# EAGLE design pi_mcu_powerBoard (EAGLE 6.3)
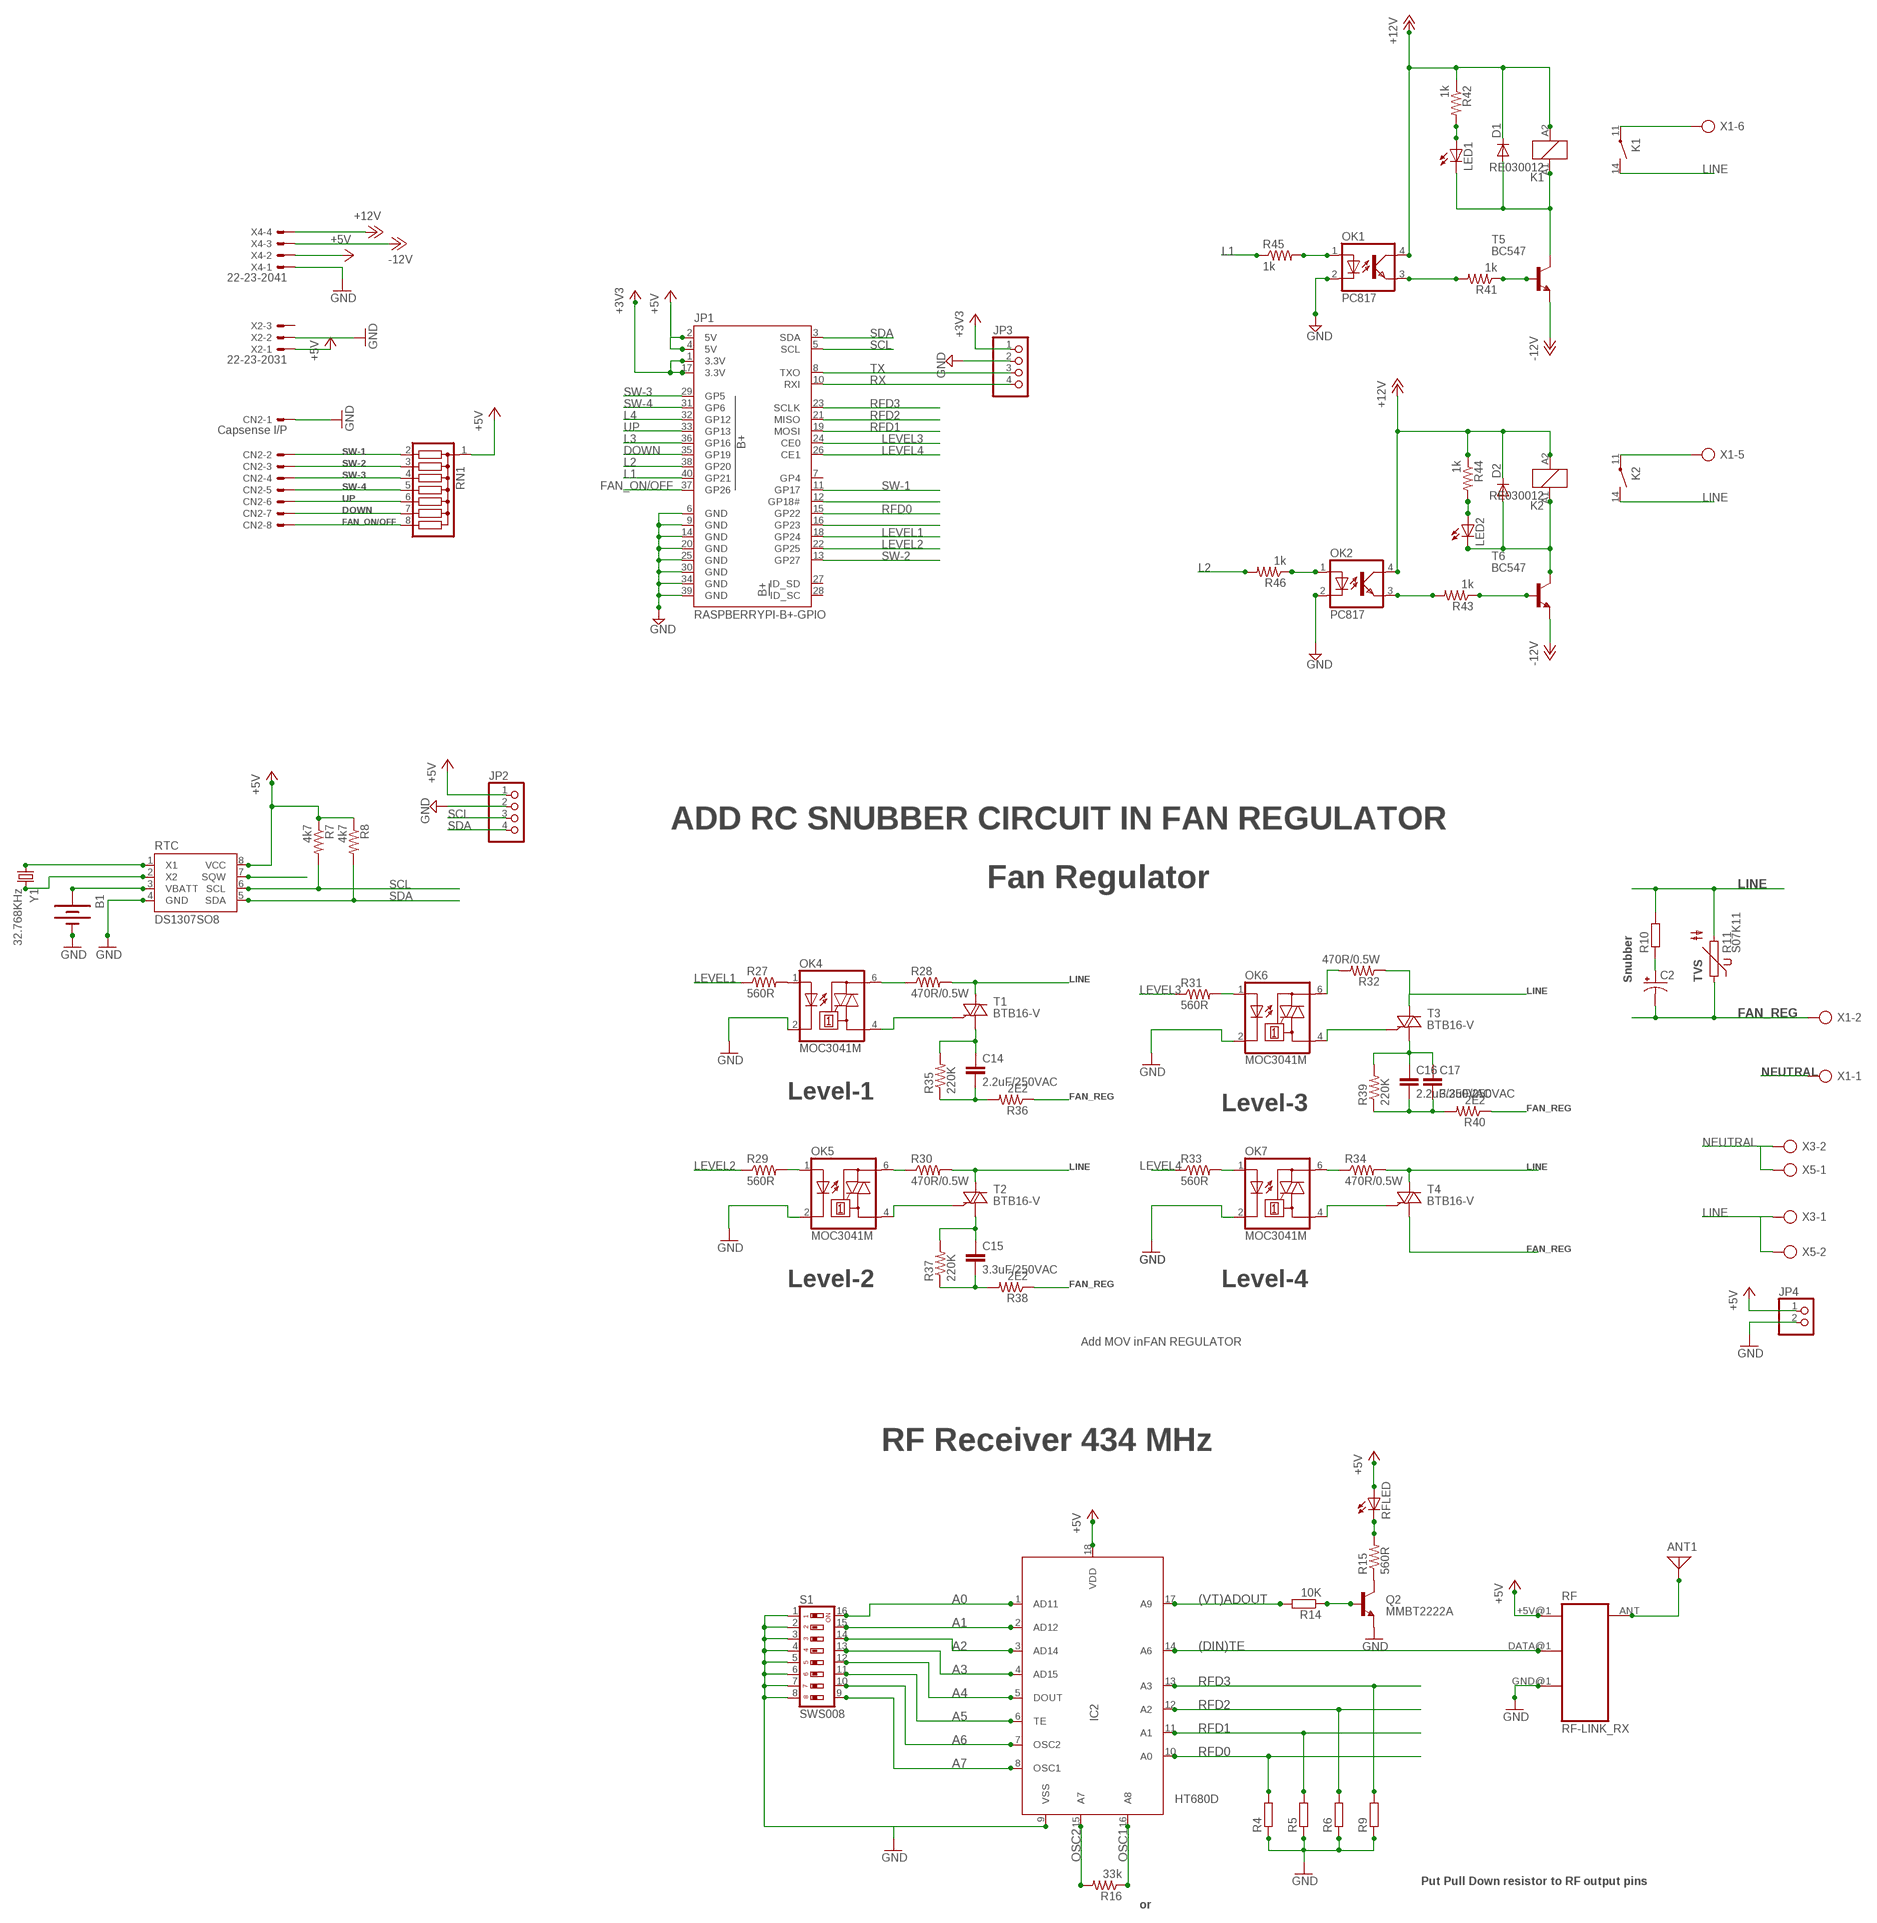
[diagram p0: schematic, sheet 1, part 1 of 2]
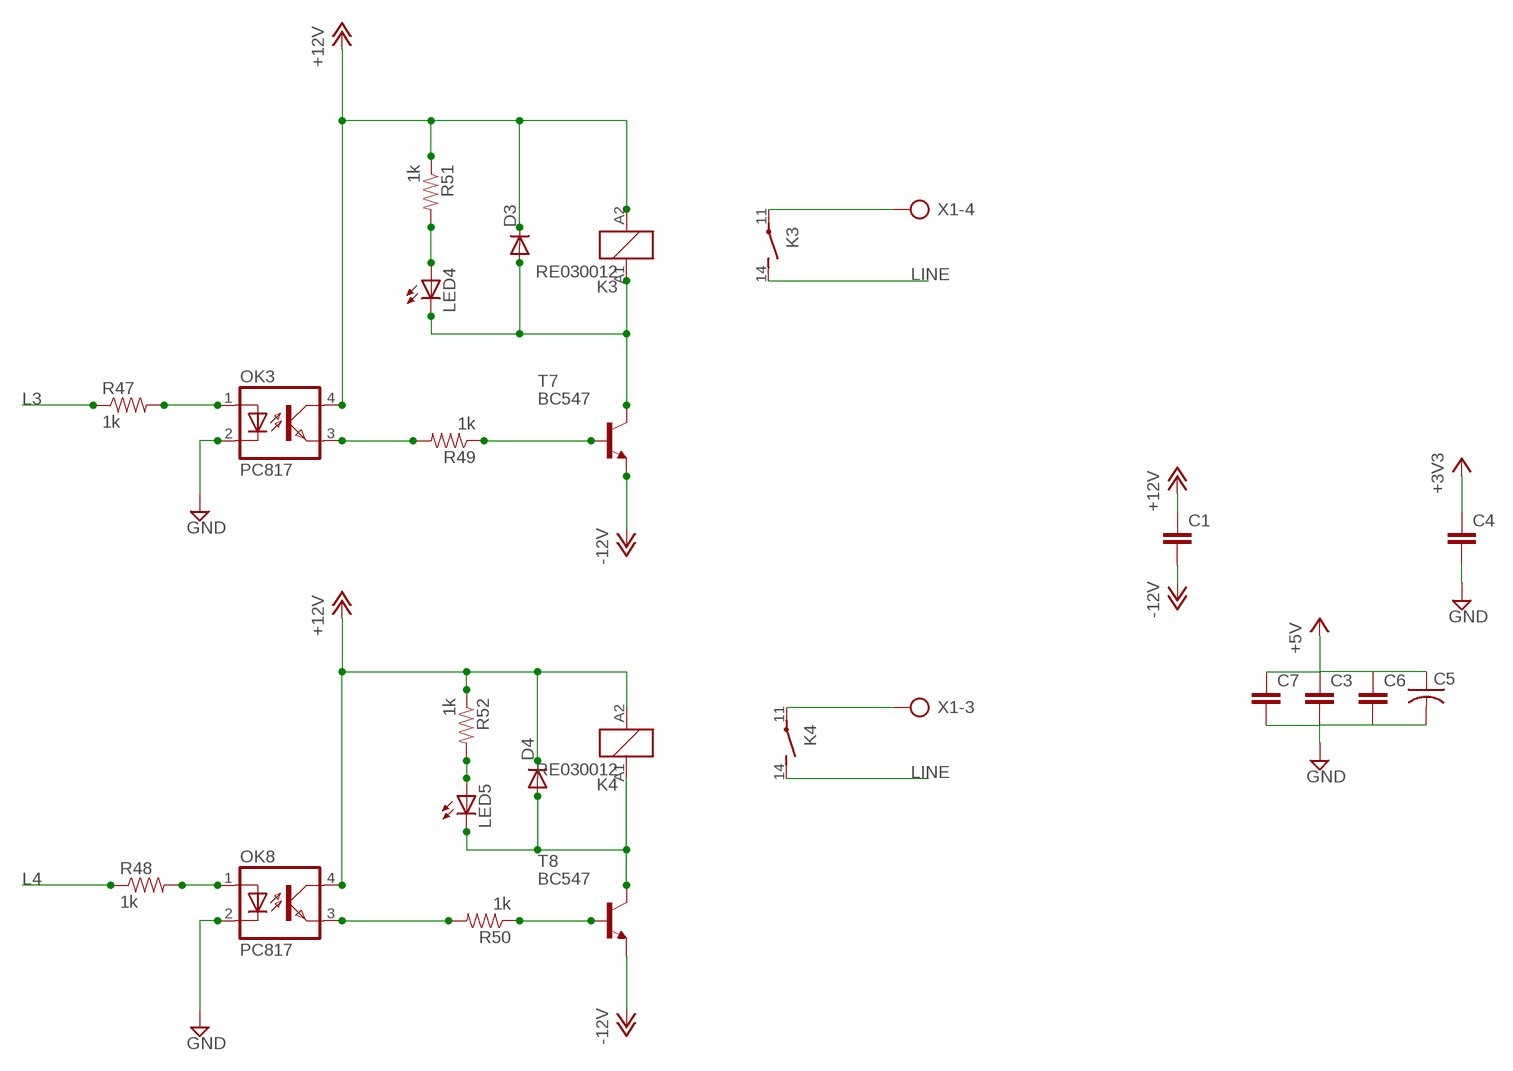
[diagram p1: schematic, sheet 1, part 2 of 2]

## Parts
ANT1  ANTENNA  [PAD-01]
B1  BATTERY20SMD  [BATTCON_20MM]
C1  C-EUC1206  [C1206]
C2  CPOL-USE5-9VAXIAL  [E5R]
C3  C-EUC1206  [C1206]
C4  C-EUC1206  [C1206]
C5  C-USC1206  [C1206]
C6  C-EUC1206  [C1206]
C7  C-EUC1206  [C1206]
C14  2.2uF/250VAC  C27/9  [C27.5B9]
C15  3.3uF/250VAC  C27/9  [C27.5B9]
C16  2.2uF/250VAC  C27/9  [C27.5B9]
C17  3.3uF/250VAC  C27/9  [C27.5B9]
CN2  Capsense I/P  22-23-2081  [22-23-2081]
D1  DIODE-D-2.5  [D-2.5]
D2  DIODE-D-2.5  [D-2.5]
D3  DIODE-D-2.5  [D-2.5]
D4  DIODE-D-2.5  [D-2.5]
IC2  HT680D  [SOP18]
JP1  RASPBERRYPI-B+-GPIO  [2X20-SHROUDED]
JP2  PINHD-1X4  [1X04]
JP3  PINHD-1X4  [1X04]
JP4  PINHD-1X2  [1X02]
K1  RE030012  [RE-SCHRACK]
K2  RE030012  [RE-SCHRACK]
K3  RE030012  [RE-SCHRACK]
K4  RE030012  [RE-SCHRACK]
LED1  LED3MM  [LED3MM]
LED2  LED3MM  [LED3MM]
LED4  LED3MM  [LED3MM]
LED5  LED3MM  [LED3MM]
OK1  PC817  [DIL04]
OK2  PC817  [DIL04]
OK3  PC817  [DIL04]
OK4  MOC3041M  [DIL06]
OK5  MOC3041M  [DIL06]
OK6  MOC3041M  [DIL06]
OK7  MOC3041M  [DIL06]
OK8  PC817  [DIL04]
Q2  MMBT2222A  TRANSISTOR_NPNMMBT2222A  [SOT23-3]
R4  R-EU_0207/10  [0207/10]
R5  R-EU_0207/10  [0207/10]
R6  R-EU_0207/10  [0207/10]
R7  4k7  RESISTOR1206  [1206]
R8  4k7  RESISTOR1206  [1206]
R9  R-EU_0207/10  [0207/10]
R10  R-EU_0411/3V  [0411V]
R11  S07K11  [S07K11]
R14  10K  R-EU_0207/10  [0207/10]
R15  560R  RESISTOR1206  [1206]
R16  33k  RESISTOR1206  [1206]
R27  560R  RESISTOR1206  [1206]
R28  470R/0.5W  R-US_0411/3V  [0411V]
R29  560R  RESISTOR1206  [1206]
R30  470R/0.5W  R-US_0411/3V  [0411V]
R31  560R  RESISTOR1206  [1206]
R32  470R/0.5W  R-US_0411/3V  [0411V]
R33  560R  RESISTOR1206  [1206]
R34  470R/0.5W  R-US_0411/3V  [0411V]
R35  220K  RESISTOR1206  [1206]
R36  2E2  RESISTOR1206  [1206]
R37  220K  RESISTOR1206  [1206]
R38  2E2  RESISTOR1206  [1206]
R39  220K  RESISTOR1206  [1206]
R40  2E2  RESISTOR1206  [1206]
R41  1k  RESISTOR1206  [1206]
R42  1k  RESISTOR1206  [1206]
R43  1k  RESISTOR1206  [1206]
R44  1k  RESISTOR1206  [1206]
R45  1k  RESISTOR1206  [1206]
R46  1k  RESISTOR1206  [1206]
R47  1k  RESISTOR1206  [1206]
R48  1k  RESISTOR1206  [1206]
R49  1k  RESISTOR1206  [1206]
R50  1k  RESISTOR1206  [1206]
R51  1k  RESISTOR1206  [1206]
R52  1k  RESISTOR1206  [1206]
RF  RF-LINK_RX  [RF-LINK_RX]
RFLED  LED3MM  [LED3MM]
RN1  G07R  [SIL8]
RTC  DS1307SO8  [SO08]
S1  SWS008  [SMS-008]
T1  BTB16-V  BT138-V  [TO220BV]
T2  BTB16-V  BT138-V  [TO220BV]
T3  BTB16-V  BT138-V  [TO220BV]
T4  BTB16-V  BT138-V  [TO220BV]
T5  BC547  [TO92]
T6  BC547  [TO92]
T7  BC547  [TO92]
T8  BC547  [TO92]
X1  AK300/6  [AK300/6]
X2  22-23-2031  [22-23-2031]
X3  AK300/2  [AK300/2]
X4  22-23-2041  [22-23-2041]
X5  AK300/2  [AK300/2]
Y1  32.768KHz  CRYSTALTC26H  [TC26H]

## Nets
(DIN)TE: IC2.14(A6) RF.DATA@1(DATA)
(VT)ADOUT: IC2.17(A9) R14.2
+3V3: C4.1 JP1.1(3.3V) JP1.17(3.3V) JP3.1
+5V: C3.1 C5.1 C6.1 C7.1 IC2.18(VDD) JP1.2(5V) JP1.4(5V) JP2.1 JP4.1 R7.1 R8.1 RF.+5V@1(+5V) RFLED.A RN1.1 RTC.8(VCC) X2.1 X4.2
+12V: C1.1 D1.C D2.C D3.C D4.C K1.A2 K2.A2 K3.A2 K4.A2 OK1.4(COL) OK2.4(COL) OK3.4(COL) OK8.4(COL) R42.1 R44.1 R51.1 R52.1 X4.4
-12V: C1.2 T5.1(E) T6.1(E) T7.1(E) T8.1(E) X4.3
A0: IC2.1(AD11) S1.16
A1: IC2.2(AD12) S1.15
A2: IC2.3(AD14) S1.14
A3: IC2.4(AD15) S1.13
A4: IC2.5(DOUT) S1.12
A5: IC2.6(TE) S1.11
A6: IC2.7(OSC2) S1.10
A7: IC2.8(OSC1) S1.9
DOWN: CN2.7 JP1.35(GP19) RN1.7
FAN_ON/OFF: CN2.8 JP1.37(GP26) RN1.8
FAN_REG: C2.- R11.1 R36.1 R38.1 R40.1 T4.T1(A1) X1.2
GND: B1.2(-) C3.2 C4.2 C5.2 C6.2 C7.2 CN2.1 IC2.9(VSS) JP1.6(GND) JP1.9(GND) JP1.14(GND) JP1.20(GND) JP1.25(GND) JP1.30(GND) JP1.34(GND) JP1.39(GND) JP2.2 JP3.2 JP4.2 OK1.2(C) OK2.2(C) OK3.2(C) OK4.2(C) OK5.2(C) OK6.2(C) OK7.2(C) OK8.2(C) Q2.2(E) R4.1 R5.1 R6.1 R9.1 RF.GND@1(GND) RTC.4(GND) S1.1 S1.2 S1.3 S1.4 S1.5 S1.6 S1.7 S1.8 X2.2 X4.1
L1: JP1.40(GP21) R45.1
L2: JP1.38(GP20) R46.2
L3: JP1.36(GP16) R47.1
L4: JP1.32(GP12) R48.1
LEVEL1: JP1.18(GP24) R27.1
LEVEL2: JP1.22(GP25) R29.1
LEVEL3: JP1.24(CE0) R31.1
LEVEL4: JP1.26(CE1) R33.1
LINE: K1.14(2:S) K2.14(2:S) K3.14(2:S) K4.14(2:S) R10.2 R11.2 R28.2 R30.2 R32.1 R34.2 T1.T2(A2) T2.T2(A2) T3.T2(A2) T4.T2(A2) X3.1 X5.2
N$1: OK6.1(A) R31.2
N$2: OK4.1(A) R27.2
N$3: OK5.1(A) R29.2
N$4: OK4.6(A2) R28.1
N$5: OK7.1(A) R33.2
N$6: JP1.16(GP23)
N$7: OK1.3(EMIT) R41.2
N$8: JP1.12(GP18#)
N$9: R41.1 T5.2(B)
N$10: D1.A K1.A1 LED1.K(C) T5.3(C)
N$11: LED1.A R42.2
N$12: OK1.1(A) R45.2
N$13: RTC.2(X2) Y1.2
N$14: OK2.1(A) R46.1
N$15: OK2.3(EMIT) R43.2
N$16: R43.1 T6.2(B)
N$17: C2.+ R10.1
N$18: D2.A K2.A1 LED2.K(C) T6.3(C)
N$19: Q2.1(B) R14.1
N$20: RTC.7(SQW)
N$21: RTC.1(X1) Y1.1
N$22: K3.11(2:P) X1.4
N$23: B1.1(+) RTC.3(VBATT)
N$24: Q2.3(C) R15.1
N$25: LED2.A R44.2
N$26: K1.11(2:P) X1.6
N$27: R15.2 RFLED.K(C)
N$28: K2.11(2:P) X1.5
N$29: OK5.6(A2) R30.1
N$30: OK6.6(A2) R32.2
N$31: ANT1.1 RF.ANT
N$32: OK3.1(A) R47.2
N$33: OK8.3(EMIT) R50.2
N$34: OK7.6(A2) R34.1
N$35: OK3.3(EMIT) R49.2
N$36: R49.1 T7.2(B)
N$37: R50.1 T8.2(B)
N$38: D3.A K3.A1 LED4.K(C) T7.3(C)
N$39: K4.11(2:P) X1.3
N$40: LED4.A R51.2
N$41: D4.A K4.A1 LED5.K(C) T8.3(C)
N$43: LED5.A R52.2
N$44: OK8.1(A) R48.2
N$54: OK4.4(A1) T1.G
N$55: C14.1 R35.2 T1.T1(A1)
N$56: C14.2 R35.1 R36.2
N$62: OK5.4(A1) T2.G
N$63: C15.1 R37.2 T2.T1(A1)
N$64: C15.2 R37.1 R38.2
N$70: OK6.4(A1) T3.G
N$71: C16.1 C17.1 R39.2 T3.T1(A1)
N$72: C16.2 C17.2 R39.1 R40.2
N$78: OK7.4(A1) T4.G
NEUTRAL: X1.1 X3.2 X5.1
OSC1: IC2.16(A8) R16.1
OSC2: IC2.15(A7) R16.2
RFD0: IC2.10(A0) JP1.15(GP22) R4.2
RFD1: IC2.11(A1) JP1.19(MOSI) R5.2
RFD2: IC2.12(A2) JP1.21(MISO) R6.2
RFD3: IC2.13(A3) JP1.23(SCLK) R9.2
RX: JP1.10(RXI) JP3.4
SCL: JP1.5(SCL) JP2.3 R7.2 RTC.6(SCL)
SDA: JP1.3(SDA) JP2.4 R8.2 RTC.5(SDA)
SW-1: CN2.2 JP1.11(GP17) RN1.2
SW-2: CN2.3 JP1.13(GP27) RN1.3
SW-3: CN2.4 JP1.29(GP5) RN1.4
SW-4: CN2.5 JP1.31(GP6) RN1.5
TX: JP1.8(TXO) JP3.3
UP: CN2.6 JP1.33(GP13) RN1.6
Unconnected: JP1.7(GP4) JP1.27(ID_SD) JP1.28(ID_SC) X2.3

## Notes on the sheet
- ADD RC SNUBBER CIRCUIT IN FAN REGULATOR
- Fan Regulator
- Snubber | TVS
- Level-1
- Level-3
- Level-2 | Level-4
- Add MOV inFAN REGULATOR
- RF Receiver 434 MHz
- Put Pull Down resistor to RF output pins
- or

## Library data of the parts
ANT1 = discrete:ANTENNA: Antenna
B1 = SparkFun-Electromechanical:BATTERY: Battery Holders Various common sizes : AA, AAA, 18650 (PRT-12895), 20mm coin cell and 12mm coin cell. 20MM_4LEGS, BATT-10373
C1 C3 C4 C6 C7 = rcl:C-EU: CAPACITOR, European symbol
C2 = rcl:CPOL-US: POLARIZED CAPACITOR, American symbol
C5 = rcl:C-US: CAPACITOR, American symbol
C14-C17 = capacitor-wima:C: CAPACITOR naming: grid - package width
CN2 = con-molex:22-23-2081: .100" (2.54mm) Center Header - 8 Pin; MF: MOLEX; MPN: 22-23-2081; OC_FARNELL: 1756826; OC_NEWARK: 01C7592
D1-D4 = diode:DIODE-: DIODE
IC2 = holtek:HT680: 318 Series of Encoders TE trigger type Source: http://www.holtek.com.tw/pdf/consumer/3_18ev110.pdf; OC_FARNELL: unknown; OC_NEWARK: unknown
JP1 = SparkFun-Boards:RASPBERRYPI-B+-GPIO: Raspberry Pi B+ GPIO Header 2x20 pin connector
JP2 JP3 = pinhead:PINHD-1X4: PIN HEADER
JP4 = pinhead:PINHD-1X2: PIN HEADER
K1-K4 = relay:RE03*: Miniature PCB Relay 1 pole 6 A SCHRACK Source: http://www.schrack.com/.. 5812.pdf; MF: TYCO ELECTRONICS; MPN: RE030012; OC_FARNELL: 515840; OC_NEWARK: 17M1743
LED1 LED2 LED4 LED5 = adafruit:LED: LED
OK1-OK3 OK8 = optocoupler:PC817: SHARP OPTO COUPLER; MPN: PC817X4J000F; OC_FARNELL: 9707727; OC_NEWARK: 97K7059
OK4 = optocoupler:MOC30*: 6-Pin DIP Zero-Cross Optoisolators Triac Driver Output (250/400 Volt Peak) Source: Data sheet <http://www.fairchildsemi.com/ds/MO/MOC3031M.pdf> The old path of data sheet not more available 2013-05-06.; MF: FAIRCHILD SEMICONDUCTOR; MPN: MOC3041M; OC_FARNELL: 1086677; OC_NEWARK: 78K6090
OK5-OK7 = optocoupler:MOC30*: 6-Pin DIP Zero-Cross Optoisolators Triac Driver Output (250/400 Volt Peak) Source: Data sheet <http://www.fairchildsemi.com/ds/MO/MOC3031M.pdf> The old path of data sheet not more available 2013-05-06.; MF: FAIRCHILD SEMICONDUCTOR; MPN: MOC3031SM; OC_FARNELL: unknown; OC_NEWARK: 34C1335
Q2 = SparkFun-DiscreteSemi:TRANSISTOR_NPN: Generic NPN BJT MMBT2222A - TRANS-08049 (SOT-23, 1A 40V) MPSA42 - TRANS-09116 (SOT-23, 500mA 300V) MMBT5088LT1G - TRANS-11160 (SOT-23, 50 mA 30V) BC547 - COM-08928 <http://www.sparkfun.com/products/8928> (TO-92 45V 100mA) (1.Collector 2.Base 3.Emitter) 2N3904 - COM-00521 <http://www.sparkfun.com/products/521> (TO-92 40V 200mA) (1.Emitter 2.Base 3.Collector) P2N2222A - COM-12852 <http://www.sparkfun.com/products/12852> (TO-92 40V 600mA) (1.Collector 2.Base 3.Emitter); PROD_ID: TRANS-08049
R4-R6 R9 R10 R14 = rcl:R-EU_: RESISTOR, European symbol
R7 R8 = SparkFun-Passives:RESISTOR: Resistor Basic schematic elements and footprints for 0603, 1206, and PTH resistors.
R11 = varistor:S07K11: VARISTOR
R15 R16 R27 R29 R31 R33 R35-R52 = SparkFun-Resistors:RESISTOR: Resistor Basic schematic elements and footprints for 0603, 1206, and PTH resistors.
R28 R30 R32 R34 = rcl:R-US_: RESISTOR, American symbol
RF = SparkFun-RF:RF-LINK_RX: RF Link receivers- WRL-8947, 8948, 8949, 8950, 10532, 10533
RFLED = led:LED: LED
RN1 = resistor-sil:G07R: SIL RESISTOR; OC_FARNELL: unknown; OC_NEWARK: unknown
RTC = SparkFun-FreqCtrl:DS1307: I2C real-time clock with battery backup.
S1 = smd-special:SWS008: SMD Dip Switch 8 pol.
T1-T4 = triac:BT138: TRIAC Source: http://www.semiconductors.philips.com BT138_SERIES_2.pdf
T5-T8 = transistor:BC547: NPN TRANSISTOR
X1 = con-ptr500:AK300/6: CONNECTOR; OC_FARNELL: unknown; OC_NEWARK: unknown
X2 = con-molex:22-23-2031: .100" (2.54mm) Center Header - 3 Pin; MF: MOLEX; MPN: 22-23-2031; OC_FARNELL: 1462950; OC_NEWARK: 30C0862
X3 X5 = con-ptr500:AK300/2: CONNECTOR; OC_FARNELL: unknown; OC_NEWARK: unknown
X4 = con-molex:22-23-2041: .100" (2.54mm) Center Header - 4 Pin; MF: MOLEX; MPN: 22-23-2041; OC_FARNELL: 1462920; OC_NEWARK: 38C0355
Y1 = crystal:CRYSTAL: CRYSTAL; OC_FARNELL: unknown; OC_NEWARK: unknown

## Board
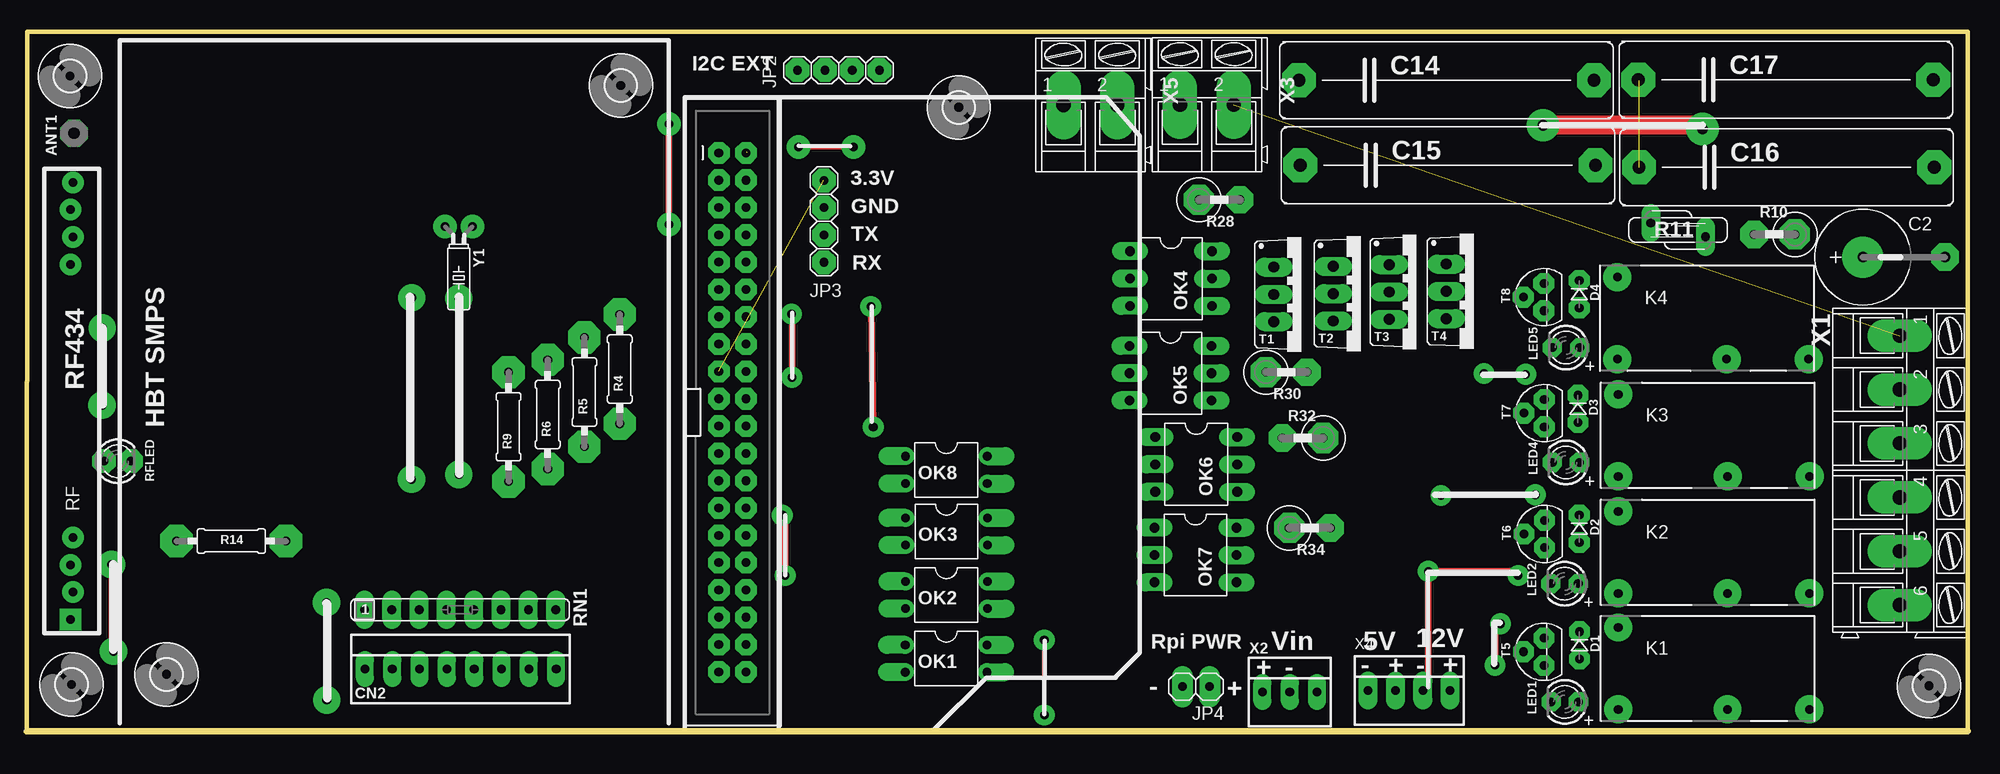
[diagram p2: board, top side]
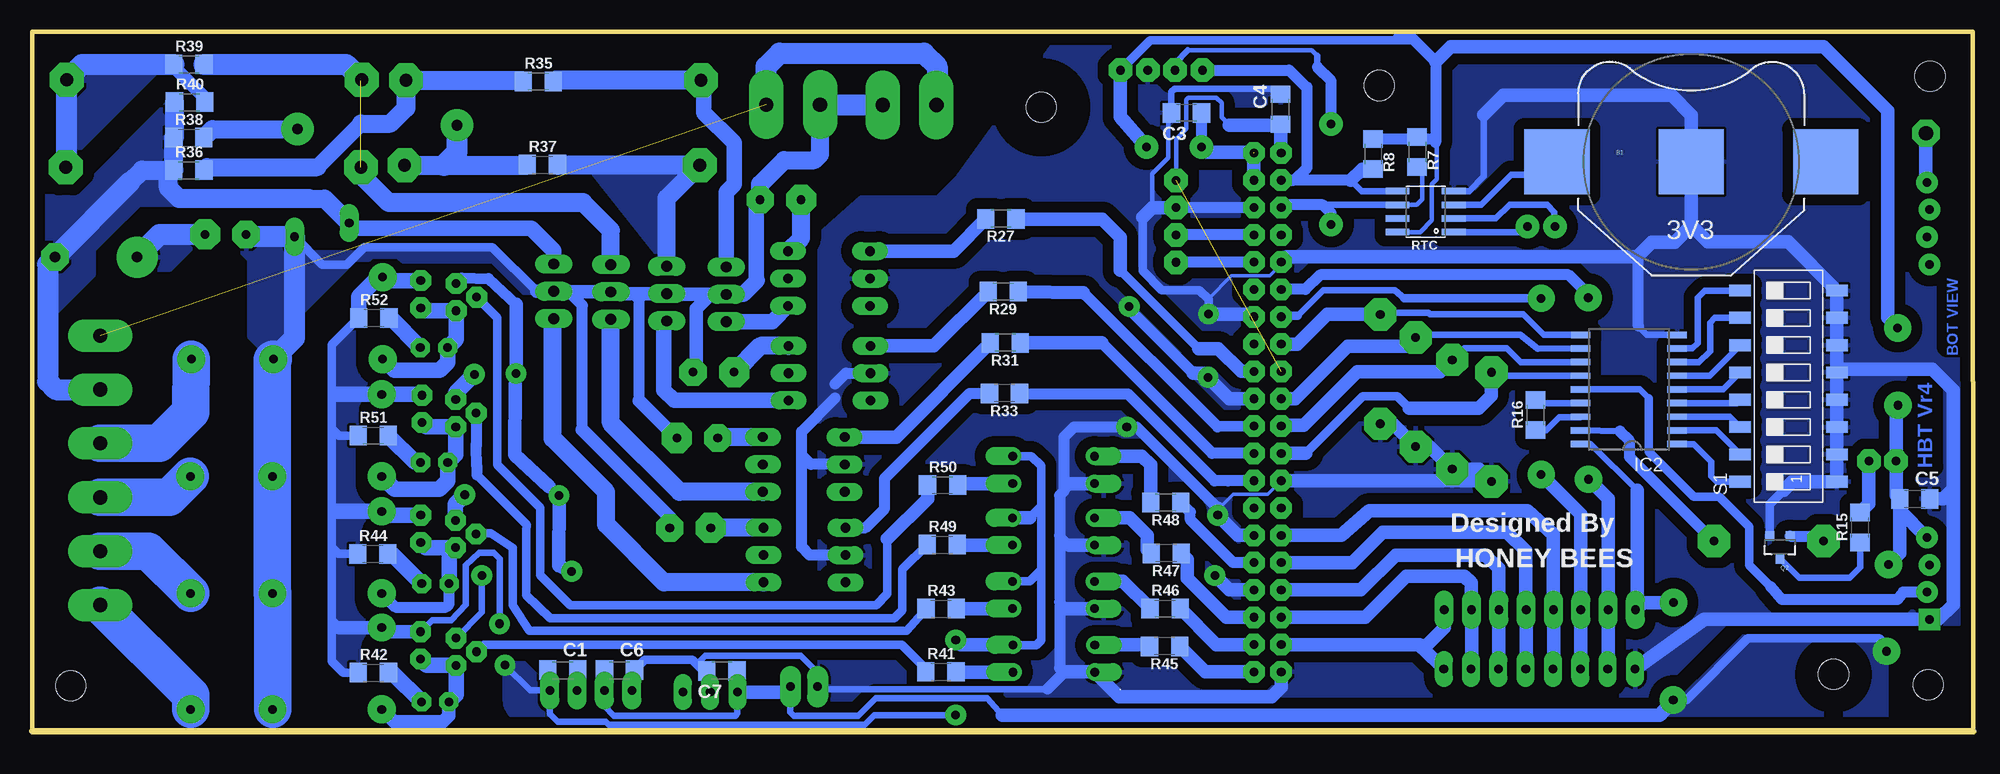
[diagram p3: board, bottom side, seen from below]

Size 180.47 x 65.04 mm. Coordinates in mm from the lower left corner, seen from the top.
Outline: 0,0 180.46,0 180.47,65.04 0.02,65.04 0,0
Copper layers (1*16): Top 0.035mm / dielectric 1.5mm / Bottom 0.035mm
Design rules "default *": minimum track width 10mil, minimum drill 24mil, track to track 8mil, track to pad 8mil, pad to pad 8mil, via to via 8mil, smd to smd 8mil, copper to edge 40mil, drill to drill 8mil, minimum pad ring 10mil, minimum via ring 8mil, stop-mask expansion 4mil, vias tented up to drill 0mil, thermal gap 10mil

### Footprints (pad centres in the part's own frame; a part is rotated, then mirrored left to right if it is on the bottom)
PAD-01 = drill 1.321 pad 2.54 octagon: 1 0,0
BATTCON_20MM = smd 6.07 x 6.07: 1 -12.5,0; 2 0,0; 3 12.5,0
C1206 = smd 1.6 x 1.8: 1 -1.4,0; 2 1.4,0
E5R = drill 1 pad 3.81: + -2.54,0 | drill 1 pad 2.54 octagon: - 5.08,0
C27.5B9 = drill 1.194 pad 3.15 octagon: 1 -13.716,0; 2 13.716,0
22-23-2081 = drill 0.8 pad 1.676 long: 1 -8.89,0; 2 -6.35,0; 3 -3.81,0; 4 -1.27,0; 5 1.27,0; 6 3.81,0; 7 6.35,0; 8 8.89,0
D-2.5 = drill 0.8 pad 1.93 octagon: A 1.27,0; C -1.27,0
SOP18 = smd 0.6 x 1.8: 1 -5.08,-4.475; 2 -3.81,-4.475; 3 -2.54,-4.475; 4 -1.27,-4.475; 5 0,-4.475; 6 1.27,-4.475; 7 2.54,-4.475; 8 3.81,-4.475; 9 5.08,-4.475; 10 5.08,4.475; 11 3.81,4.5; 12 2.54,4.5; 13 1.27,4.5; 14 0,4.5; 15 -1.27,4.5; 16 -2.54,4.5; 17 -3.81,4.5; 18 -5.08,4.5
2X20-SHROUDED = drill 0.8 pad 2 octagon: 1 -1.27,24.13; 2 1.27,24.13; 3 -1.27,21.59; 4 1.27,21.59; 5 -1.27,19.05; 6 1.27,19.05; 7 -1.27,16.51; 8 1.27,16.51; 9 -1.27,13.97; 10 1.27,13.97; 11 -1.27,11.43; 12 1.27,11.43; 13 -1.27,8.89; 14 1.27,8.89; 15 -1.27,6.35; 16 1.27,6.35; 17 -1.27,3.81; 18 1.27,3.81; 19 -1.27,1.27; 20 1.27,1.27; 21 -1.27,-1.27; 22 1.27,-1.27; 23 -1.27,-3.81; 24 1.27,-3.81; 25 -1.27,-6.35; 26 1.27,-6.35; 27 -1.27,-8.89; 28 1.27,-8.89; 29 -1.27,-11.43; 30 1.27,-11.43; 31 -1.27,-13.97; 32 1.27,-13.97; 33 -1.27,-16.51; 34 1.27,-16.51; 35 -1.27,-19.05; 36 1.27,-19.05; 37 -1.27,-21.59; 38 1.27,-21.59; 39 -1.27,-24.13; 40 1.27,-24.13
1X04 = drill 0.8 pad 2.184 octagon: 1 -3.81,0; 2 -1.27,0; 3 1.27,0; 4 3.81,0
1X02 = drill 0.8 pad 1.93 long: 1 -1.27,0; 2 1.27,0
RE-SCHRACK = drill 0.8 pad 2.6: 11 8.89,-3.81; 14 1.27,-3.81; A1 -8.89,-3.81; A2 -8.89,3.81
LED3MM = drill 0.8 pad 1.778 octagon: A -1.27,0; K 1.27,0
DIL04 = drill 0.8 pad 1.676 offset: 1 -1.27,-3.81; 2 1.27,-3.81; 3 1.27,3.81; 4 -1.27,3.81
DIL06 = drill 0.9 pad 1.676 long: 1 -2.54,-3.81; 2 0,-3.81; 3 2.54,-3.81; 4 2.54,3.81; 5 0,3.81; 6 -2.54,3.81
SOT23-3 = smd 0.8 x 0.9: 1 -0.95,-1; 2 0.95,-1; 3 0,1.1
0207/10 = drill 0.8 pad 3 octagon: 1 -5.08,0; 2 5.08,0
1206 = smd 1.6 x 1.8: 1 -1.4,0; 2 1.4,0
0411V = drill 0.8 pad 2.8 octagon: 1 -2.54,0 | drill 0.8 pad 2.54 octagon: 2 1.27,0
S07K11 = drill 0.8 pad 1.778 long: 1 -0.635,-2.54; 2 0.635,2.54
RF-LINK_RX = drill 0.8 pad 2: +5V@1 7.62,-0.127; +5V@2 33.02,0.127; ANT 40.64,-0.127; DATA@1 2.54,-0.127; DATA@2 5.08,0.127; GND@2 35.56,-0.127; GND@3 38.1,0.127 | drill 0.8 pad 2 square: GND@1 0,0.127
LED3MM' = drill 0.8 pad 2.184 octagon: A -1.27,0; K 1.27,0
SIL8 = drill 0.813 pad 1.778 long: 1 -8.89,0; 2 -6.35,0; 3 -3.81,0; 4 -1.27,0; 5 1.27,0; 6 3.81,0; 7 6.35,0; 8 8.89,0
SO08 = smd 0.61 x 2.21: 1 -1.905,-2.616; 2 -0.635,-2.616; 3 0.635,-2.616; 4 1.905,-2.616; 5 1.905,2.616; 6 0.635,2.616; 7 -0.635,2.616; 8 -1.905,2.616
SMS-008 = smd 1.092 x 2.007: 1 -8.89,-4.496; 2 -6.35,-4.496; 3 -3.81,-4.496; 4 -1.27,-4.496; 5 1.27,-4.496; 6 3.81,-4.496; 7 6.35,-4.496; 8 8.89,-4.496; 9 8.89,4.496; 10 6.35,4.496; 11 3.81,4.496; 12 1.27,4.496; 13 -1.27,4.496; 14 -3.81,4.496; 15 -6.35,4.496; 16 -8.89,4.496
TO220BV = drill 1 pad 1.75 long: G 2.54,-2.54; T1 -2.54,-2.54; T2 0,-2.54
TO92 = drill 0.8 pad 1.93 octagon: 1 1.27,0; 2 0,1.905; 3 -1.27,0
2,8 = hole 2.8: 0,0
AK300/6 = drill 1.321 pad 3 long: 1 -12.522,0; 2 -7.518,0; 3 -2.515,0; 4 2.515,0; 5 7.518,0; 6 12.522,0
22-23-2031 = drill 0.8 pad 1.676 long: 1 -2.54,0; 2 0,0; 3 2.54,0
AK300/2 = drill 1.321 pad 3.2 long: 1 -2.515,0; 2 2.489,0
22-23-2041 = drill 0.8 pad 1.778 long: 1 -3.81,0; 2 -1.27,0; 3 1.27,0; 4 3.81,0
TC26H = drill 0.8 pad 2.184: 1 -1.27,0; 2 1.27,0

### Placement (x,y rotation side)
ANT1  4.38,55.59 0 top
B1  26.2,52.94 0 bottom
C1  131.14,5.67 0 bottom
C2  173.25,44.08 0 top
C3  73.14,57.48 180 bottom
C4  64.39,57.83 90 bottom
C5  5.43,21.59 0 bottom
C6  125.85,5.67 0 bottom
C7  116.33,5.6 180 bottom
C14  131.99,60.51 0 top
C15  132.12,52.61 0 top
C16  163.61,52.42 0 top
C17  163.54,60.55 0 top
CN2  40.32,5.79 0 top
D1  144.35,7.97 270 top
D2  144.33,18.81 270 top
D3  144.22,29.96 270 top
D4  144.33,40.63 270 top
IC2  32,31.77 90 bottom
JP1  65.6,29.63 0 top
JP2  75.47,61.45 180 top
JP3  74.1,47.4 270 top
JP4  108.7,4.14 180 top
K1  156.85,5.83 0 top
K2  156.85,16.62 0 top
K3  156.85,27.5 0 top
K4  156.77,38.41 0 top
LED1  142.99,2.72 180 top
LED2  142.97,13.71 180 top
LED4  143.09,24.98 180 top
LED5  143.11,35.66 180 top
OK1  85.47,6.75 270 top
OK2  85.49,12.66 270 top
OK3  85.5,18.56 270 top
OK4  106.38,42.08 270 top
OK5  106.33,33.28 270 top
OK6  108.72,24.79 270 top
OK7  108.65,16.38 270 top
OK8  85.49,24.29 270 top
Q2  17.95,17.13 180 bottom
R4  55.12,33.66 90 top
R5  51.83,31.53 90 top
R6  48.42,29.44 90 top
R7  51.69,53.85 270 bottom
R8  55.8,53.66 270 bottom
R9  44.78,28.29 90 top
R10  161.85,46.19 180 top
R11  153.52,46.6 270 top
R14  19,17.68 0 top
R15  10.51,18.93 90 bottom
R16  40.68,29.4 90 bottom
R27  90.39,47.63 180 bottom
R28  111.51,49.41 0 top
R29  90.18,40.87 180 bottom
R30  117.74,33.37 0 top
R31  89.98,36.09 180 bottom
R32  117.99,27.25 180 top
R33  90.06,31.4 180 bottom
R34  119.91,18.89 0 top
R35  133.42,60.41 0 bottom
R36  165.89,52.17 0 bottom
R37  133.02,52.68 0 bottom
R38  165.91,55.18 0 bottom
R39  165.89,62 0 bottom
R40  165.82,58.48 0 bottom
R41  95.97,5.52 0 bottom
R42  148.74,5.45 0 bottom
R43  95.96,11.4 0 bottom
R44  148.8,16.48 0 bottom
R45  75.17,7.87 180 bottom
R46  75.13,11.41 0 bottom
R47  75.03,16.53 180 bottom
R48  75.06,21.25 180 bottom
R49  95.84,17.35 0 bottom
R50  95.81,22.88 0 bottom
R51  148.76,27.49 0 bottom
R52  148.69,38.43 0 bottom
RF  4.17,10.38 90 top
RFLED  [LED3MM']  8.43,25.1 0 top
RN1  40.28,11.28 0 top
RTC  50.9,48.3 90 bottom
S1  17.16,32.08 90 bottom
T1  118.48,40.6 270 top
T2  124,40.68 270 top
T3  129.2,40.83 270 top
T4  134.52,40.89 270 top
T5  141.05,7.38 90 top
T6  141.11,18.33 90 top
T7  141.08,29.56 90 top
T8  141.04,40.35 90 top
U$3  [2,8]  55.22,60.03 0 top
U$4  [2,8]  12.98,5.29 0 top
U$5  [2,8]  4.01,60.89 0 top
U$6  [2,8]  4.16,4.32 0 top
U$7  [2,8]  176.87,4.22 0 top
U$8  [2,8]  86.64,58 0 top
X1  174.14,24.24 270 top
X2  117.42,3.63 0 top
X3  109.72,58.25 0 top
X4  128.52,3.78 0 top
X5  98.9,58.21 0 top
Y1  40.15,46.91 180 top

### Tracks (layer width: path | path; a pad name or v marks a point on that pad's centre or on a via)
(DIN)TE
  Bottom 0.61: 30.15,30.93 30.99,31.77 IC2.14
  Bottom 0.813: 30.15,30.93 30.15,25.97 25.97,21.79 24.51,21.79 24.02,21.79 23.59,21.79 20.81,19.01 20.81,15.42 18.85,13.46
  Bottom 1.016: RF.DATA@1 6.5,12.92 7.04,12.24 17.78,12.24 18.85,13.46
(VT)ADOUT
  Bottom 0.61: 32.84,27.9 IC2.17
  Bottom 1.016: R14.2 24.13,17.68 31.93,25.48 31.93,26.99 32.84,27.9
+3V3  (1 unrouted)
  Bottom 0.406: JP3.1 74.1,55.05 73.15,56 73.15,58.73 72.97,58.9 70.35,58.9 69.86,58.42 69.86,57.06 69.14,56.34 | C4.1
  Bottom 1.27: JP1.1 64.39,53.82 C4.1 64.47,56.34 69.14,56.34
+5V  (via drill 0.8 pad 2.18, 0.8 pad 2.54)  (1 unrouted)
  Top 0.406: v76.85,54.31 71.81,54.24 v71.74,54.31
  Top 0.61: v8.05,7.43 7.87,7.43 v7.87,15.5 | v27.85,11.96 27.85,2.92 | 6.99,37.49 v6.99,30.3
  Top 1.27: 27.85,2.92 v27.88,2.89 | v7.01,37.49 6.99,37.49
  Bottom 0.406: 50.28,55.06 49.96,54.74 49.85,54.63 49.85,51.32 50.31,50.86 50.31,47.51 51.42,46.4 RTC.8 | X2.1
  Bottom 0.61: 51.88,55.06 R7.1 | IC2.18 35.54,26.69 31.22,22.38 | X2.1 114.88,1.69 115.04,1.43 126.38,1.43 127.25,2.35 X4.2 | JP4.1 109.97,1.74 109.66,1.43 103.66,1.43 102.05,3.04 91.68,3.04 90.27,1.49
  Bottom 0.813: C7.1 114.93,3.69 X2.1 114.88,3.7 | X4.2 C6.1 | v8.05,7.43 8.05,7.94 8.74,8.63 20.96,8.63 26.69,2.89 v27.88,2.89 | JP2.1 76.49,64.24 51.97,64.24 51.85,64.12
  Bottom 1.016: R8.1 51.88,55.06 50.28,55.06 | 49.96,54.74 49.96,62.24 51.85,64.12 52.19,64.46 53.45,64.46 | v71.74,54.31 C3.1
  Bottom 1.27: RF.+5V@1 6.83,20.53 | 6.83,20.53 C5.1 7.16,21.91 RFLED.A 7.16,30.3 v6.99,30.3 | 31.22,22.38 31.22,11.45 RN1.1 30.71,11.96 v27.85,11.96 | X2.1 110.47,3.63 JP4.1 | v7.87,15.5 6.83,16.54 6.83,20.53 | 49.96,62.24 48.58,63.62 13.89,63.62 7.94,57.68 7.94,38.42 v7.01,37.49 | 66.92,53.82 71.25,53.82 v71.74,54.31 | 90.27,1.49 29.14,1.49 v27.88,2.89 | v76.85,54.31 79.28,57.1 JP2.1 | JP1.4 JP1.2
  pour Bottom: 8.17,7.58 9.29,8.7 21.38,8.7 29.6,0.48 29.6,0.22 8.15,0.22 8.15,7.57
+12V  (via drill 0.8 pad 1.93)
  Top 0.406: v94.6,1.5 94.59,2.81 v94.59,8.47
  Top 0.61: v137,9.99 136.5,9.49 v136.5,6.14
  Bottom 0.406: 94.63,1.47 v94.6,1.5
  Bottom 0.61: D1.C 143.29,10.31 141.51,10.31 140.14,11.73 140.14,15.42 138.91,16.59 137.56,16.59 137,16.03 v137,9.99 | v136.5,6.14 134.15,3.78 X4.4 132.33,1.62 131.61,0.9 127.13,0.9 126.83,0.6 103.05,0.6 102.18,1.47 94.63,1.47
  Bottom 0.813: OK8.4 87.56,25.56 86.65,24.65 86.65,20.89 | 86.65,20.89 86.65,14.99 | 86.65,14.99 86.65,8.47 87.12,8 89.26,8 OK1.4 | OK2.4 87.72,13.93 86.65,14.99 | 87.71,19.83 86.65,20.89 | 148.37,42.09 148.01,42.09 K4.A2 | R52.1 152.6,35.92 152.6,31.86 | 152.6,31.86 152.6,28.12 | 152.6,28.12 152.6,20.91 | 152.6,20.91 152.6,17.08 | 152.6,17.08 152.6,10.31 | 152.6,10.31 152.6,6.51 151.55,5.45 R42.1 | 151.93,9.64 152.6,10.31 | R44.1 152.01,16.48 152.6,17.08 | 152.12,20.43 152.6,20.91 | R51.1 151.97,27.49 152.6,28.12 | 152.05,31.31 152.6,31.86 | 144.29,31.31 D3.C | K2.A2 147.61,20.08 | X4.4 132.54,3.99 C1.1
  Bottom 1.27: OK3.4 87.71,19.83 | K4.A2 147.55,41.9 | 151.93,9.64 K1.A2 147.56,9.24 D1.C | v94.59,8.47 94.14,8.02 OK1.4
  Bottom 1.422: 147.55,41.9 D4.C | R52.1 150.09,40.37 148.37,42.09 | K2.A2 152.12,20.43 | 152.05,31.31 K3.A2 144.29,31.31 | 147.61,20.08 D2.C
  pour Bottom: 150.58,37.8 150.58,34.39 arc-90 148.1,31.9 arc-90 150.3,29.7 150.3,27.65 arc90 150.58,27.37 152.48,27.37 arc90 152.63,27.52 152.63,35.91 152.48,35.91 150.58,37.8
  pour Bottom: 150.61,27.1 150.61,23.09 arc-90 147.96,20.45 arc-90 150.07,18.33 150.07,16.44 arc90 150.52,15.99 152.52,15.99 152.52,27.1 150.61,27.1
  pour Bottom: 150.7,16.37 150.7,12.44 arc-90 148.01,9.75 arc-90 150.09,7.68 150.09,5.08 arc90 152.62,7.62 152.62,16.4 152.6,16.38 150.72,16.38
  pour Bottom: 131.72,0.95 134.49,0.95 arc90 136.41,2.87 136.41,6.1 arc-90 136.52,6.22 134.71,6.22 132.33,3.84 132.33,1.59 131.72,0.97
-12V  (via drill 0.8 pad 1.93)
  Top 0.406: v135.47,33.25 135.45,33.21 v139.35,33.18
  Top 0.61: v140.24,21.98 v131.48,21.92 | v138.65,14.47 138.26,14.86 v130.3,14.86 130.3,4.29 X4.3
  Bottom 0.61: v131.48,21.92 132.38,22.72 | 135.54,32.25 v135.47,33.25 | T5.1 138.65,11.04 v138.65,14.47
  Bottom 0.813: X4.3 129.74,3.83 C1.2
  Bottom 1.016: T8.1 140.52,42.14 138.03,42.07 135.47,39.68
  Bottom 1.27: 135.47,39.68 v135.47,33.25 | 132.38,22.72 135.6,25.68 135.54,32.25 | v130.3,14.86 131.5,15.37 v131.48,21.92
  Bottom 1.422: v139.35,33.18 141.08,31.44 T7.1 | T6.1 141.11,21.11 v140.24,21.98
A0
  Bottom 0.61: IC2.1 25.97,26.69 24.34,25.07 24.34,23.68 23.84,23.18 21.67,23.18 S1.16
A1
  Bottom 0.61: S1.15 23.89,27.96 IC2.2
A2
  Bottom 0.61: S1.14 22.62,29.23 IC2.3
A3
  Bottom 0.61: S1.13 21.96,30.5 IC2.4
A4
  Bottom 0.61: S1.12 23.23,31.77 IC2.5
A5
  Bottom 0.61: S1.11 24.5,33.04 IC2.6
A6
  Bottom 0.61: S1.10 21.91,38.43 21.92,38.42 24.02,38.42 24.46,37.97 24.46,35.34 25.49,34.31 IC2.7
A7
  Bottom 0.61: IC2.8 26.1,35.58 25.62,36.07 25.62,40.3 24.97,40.95 21.67,40.95 S1.9
DOWN
  Bottom 1.27: 46.67,11.24 RN1.7 | JP1.35 56.53,10.59 52.7,14.41 47.3,14.41 46.66,13.78 46.66,11.31 RN1.7 | CN2.7 46.63,5.79 RN1.7
FAN_ON/OFF
  Bottom 1.27: CN2.8 51.1,7.68 | 51.1,7.68 51.47,8.05 JP1.37 | RN1.8 49.17,9.61 51.1,7.68
FAN_REG
  Bottom 1.422: T4.T1 131.97,44.67 134.05,46.74 150.49,46.74 151.35,47.6
  Bottom 1.676: 154.74,49.52 153.26,49.52 151.35,47.6 R11.1
  Bottom 1.778: 171.39,51.02 170.24,52.17 167.8,52.17 | 167.8,52.17 R36.1 167.31,52.18 R38.1 167.22,55.26 R40.1 | 154.74,49.52 166.8,49.52 167.8,50.51 167.8,52.17
  Bottom 1.93: X1.2 178.27,31.76 179.02,32.52 179.02,43.39 C2.- 171.39,51.02
  pour Bottom (isolate 1.016, rank 2): 167.1,48.94 170.52,48.94 173.32,46.14 174.72,44.75 174.72,42.44 178.59,38.57 179.63,38.57 180.07,39.01 180.07,49.27 179.6,49.74 176.52,49.74 167.88,58.38 167.09,58.38 167.08,58.38 167.08,48.94
GND  (via drill 0.8 pad 1.93)
  Top 0.61: v70.5,14.47 70.5,19.81 | v71.15,32.89 71.15,38.72 | v78.69,28.27 78.49,39.45 v78.47,39.47
  Top 0.813: 70.5,19.81 v70.23,20.08 | 71.15,38.72 v71.08,38.78
  Bottom 0.305: 63.83,44.11 63.83,43.89 65.39,42.33 68.96,42.33 71.09,40.2 71.09,39.48 | JP1.25 65.59,22.03 68.79,22.03 70.08,20.74 70.23,20.74
  Bottom 0.406: 106.83,3.9 107.07,4.14 | C3.2 74.83,57.18 74.83,53.32 76.32,51.83 76.32,48.67
  Bottom 0.61: RTC.4 46.85,50.21 45.48,51.58 45.48,57.33 | 74.08,48.69 JP3.2 | 26.2,51.38 B1.2 | 118.67,6.22 117.86,7.02 109.01,7.02 107.43,5.44 JP4.2 107.07,4.14 | 86.06,3.9 106.83,3.9 | v78.47,39.47 78.47,39.23 | 71.53,33.27 v71.15,32.89 | IC2.9 30.32,36.85 31.13,37.66 | 31.13,44.21 30.85,44.48 | 74.56,57.5 C3.2 74.54,59.43 74.22,59.75 64.91,59.75 C4.2
  Bottom 0.813: 83.83,23.02 84.93,21.93 | 84.93,5.89 84.55,5.51 84.45,5.51 | 81.7,5.51 OK1.2 | 84.29,11.39 84.93,12.03 | 84.05,17.29 84.93,18.17 | X2.2 117.73,3.95 C7.2 118.05,5.6 118.67,6.22 119.08,6.63 123.5,6.63 C6.2 124.45,4.04 X4.1 | v71.08,38.78 v71.09,38.79 71.09,39.48 71.09,40.14 71.94,41 75.42,41 77.21,42.79 77.21,47.78 | Q2.2 18.9,21.09 17.61,22.38
  Bottom 1.016: 84.93,5.89 84.93,12.03 84.93,18.17 84.93,21.93 84.54,22.32 84.54,27.34 83.6,28.27 v78.69,28.27 77.77,28.27 70.23,20.74 | 84.45,5.51 86.06,3.9 | 78.47,39.23 72.51,33.27 | 31.13,37.66 31.13,44.21 | JP1.6 66.88,48.67 JP3.2 | OK7.2 108.17,16.38 108.92,17.13 108.92,25.66 | 108.92,25.66 108.92,27.86 105.82,30.96 | 105.82,32.27 104.81,33.28 OK5.2 | OK6.2 108.06,24.79 108.92,25.66
  Bottom 1.27: OK8.2 83.83,23.02 | 84.45,5.51 81.7,5.51 | OK2.2 84.29,11.39 | OK3.2 84.05,17.29 | JP1.30 68.35,18.21 v70.23,20.08 70.23,20.74 | JP1.39 64.33,4.06 65.19,3.19 79.38,3.19 OK1.2 | JP1.34 69.15,13.13 v70.5,14.47 | JP1.20 69.16,30.91 v71.15,32.89 | v71.08,38.78 67.13,38.78 JP1.14 | 72.51,33.27 71.53,33.27 | 12.67,33.88 S1.5 S1.4 S1.3 S1.2 S1.1 16.8,23.19 17.61,22.38 | 12.67,33.88 S1.6 S1.7 S1.8 17.19,45.5 24.66,45.5 26.2,47.03 | 26.2,47.03 26.2,51.38 | 26.2,47.03 27.76,45.47 29.87,45.47 30.85,44.48 31.23,44.11 63.83,44.11 JP1.9 | R4.1 53.96,28.58 R5.1 50.51,26.45 R6.1 45.94,24.36 R9.1 44.86,23.29 JP1.25 | 1.84,22.53 1.84,11.76 3.22,10.38 RF.GND@1 24.99,10.38 CN2.1 | 1.84,22.53 1.84,31.71 3.79,33.66 12.45,33.66 12.67,33.88 | C5.2 2.78,21.59 1.84,22.53 | B1.2 26.2,57.27 28.03,59.11 43.7,59.11 45.48,57.33 | 77.21,47.78 76.32,48.67 JP3.2
  pour Bottom (isolate 1.016): 0.1,64.83 84.88,64.83 84.88,64.79 94.53,51.36 96.31,49.57 103.44,49.57 107.23,46.18 107.23,-0.58 33.31,-0.26 23.05,10 1.31,10 -0.05,11.35 -0.05,64.67 0.1,64.82
L1
  Bottom 1.27: JP1.40 71.41,5.51 R45.1
L2
  Bottom 1.27: JP1.38 70.36,8.05 R46.2
L3
  Bottom 1.27: JP1.36 69.45,10.59 73.08,14.21 73.08,15.98 R47.1
L4
  Bottom 1.016: JP1.32 68.79,15.67 72.77,19.64 72.77,20.36 R48.1
LEVEL1
  Bottom 0.813: 88.98,47.62 R27.1 | 72.01,35.57 79.29,42.84
  Bottom 1.27: 72.01,35.57 70.18,35.57 68.06,33.45 JP1.18 | 79.29,42.84 79.29,45.92 80.99,47.62 88.98,47.62
LEVEL2
  Bottom 0.813: 88.75,40.84 R29.1
  Bottom 1.016: JP1.22 70.25,28.29 82.72,40.77
  Bottom 1.27: 82.72,40.77 88.75,40.84
LEVEL3
  Bottom 0.813: R31.1
  Bottom 1.016: JP1.24 70.75,25.83 81.02,36.09
  Bottom 1.27: 81.02,36.09 R31.1
LEVEL4
  Bottom 0.61: 69.25,23.29 69.26,23.27 | 88.59,31.33 R33.1
  Bottom 1.016: JP1.26 69.25,23.29 | 69.26,23.27 70.51,23.27 78.57,31.33 88.59,31.33
LINE
  Bottom 0.813: 117.36,40.6 T1.T2 | 125.9,40.83 T3.T2 | 133.56,40.89 137.66,44.99 149.6,44.99 151.21,43.38 153.48,43.38 R11.2 | 160.36,45.97 R10.2
  Bottom 1.016: 124.01,30.74 124.01,40.11 124.57,40.68 | 129.3,28.02 129.3,39.59 130.6,40.89
  Bottom 1.27: T1.T2 121.39,40.6 T2.T2 124.57,40.68 126.5,40.68 T3.T2 131.91,40.83 T4.T2 | R30.2 118.71,33.68 118.71,39.26 117.36,40.6 | R32.1 124.01,30.74 | R34.2 121.18,19.9 129.3,28.02 | 130.6,40.89 T4.T2 | T4.T2 133.56,40.89
  Bottom 1.422: T1.T2 114.36,40.6 113.06,41.9 113.13,41.97 113.13,49.05 R28.2
  Bottom 1.676: R28.2 112.77,50.87 110.55,53.1 107.74,53.1 107.21,53.63 X3.1
  Bottom 1.93: 160.36,45.97 R11.2 156.06,36.57 K4.14 | X5.2 107.17,58.21 X3.1
  Bottom 3.5: K1.14 K2.14 K3.14 158.12,34.51 K4.14
  pour Bottom: 149.78,44.53 155.71,38.6 155.71,38.59 156.17,39.05 156.17,44.69 155.99,44.51 149.8,44.51
  pour Bottom: 158.29,34.67 160.3,36.68 160.3,43.82 161.28,44.8 161.28,45.98 arc90 161.17,46.08 158.23,46.08 arc-90 156.83,46.02 156.83,34.62
  pour Bottom: 134.54,41.82 137.71,44.99 149.6,44.99 150.85,43.74 150.85,43.73 150.74,43.84 149.18,43.84 148.91,44.11 146.46,44.11 146.02,43.67 137.68,43.67 134.76,40.75 133.13,40.75 134.52,41.81
N$1
  Bottom 1.27: R31.2 100.14,27.33 OK6.1
N$2
  Bottom 1.27: R27.2 94.8,44.62 OK4.1
N$3
  Bottom 1.27: R29.2 96.63,35.82 OK5.1
N$4
  Bottom 1.676: OK4.6 108.96,45.85 R28.1
N$5
  Bottom 1.016: OK7.1 102.97,18.92 101.2,20.69 101.2,23.49 93.29,31.4 R33.2
N$7
  Bottom 0.813: 94.53,5.48 R41.2
  Bottom 1.27: OK1.3 94.53,5.48
N$9
  Bottom 0.61: 97.37,5.79 R41.1
  Bottom 0.813: T5.2 138.48,8.05 99.63,8.05 97.37,5.79
N$10
  Bottom 1.27: K1.A1 146.8,0.86 142.28,0.86 141.72,1.42 LED1.K
  Bottom 1.422: D1.A 143.76,6.11 T5.3 141.05,3.39 LED1.K
N$11
  Bottom 1.27: 146.98,5.45 R42.2
  Bottom 1.422: LED1.A 146.98,5.45
N$12
  Bottom 0.61: 76.72,8.02 R45.2
  Bottom 1.27: OK1.1 76.72,8.02
N$13
  Bottom 0.61: RTC.2 44.37,47.67 43.09,48.95 39.61,48.95 38.93,48.26 38.93,46.96 Y1.2
N$14
  Bottom 1.27: OK2.1 79.04,13.93 R46.1
N$15
  Bottom 0.813: R43.2
  Bottom 1.27: OK2.3 R43.2
N$16
  Bottom 0.61: 139.15,18.39 T6.2
  Bottom 0.813: R43.1 99.13,9.32 134.25,9.32 135.78,11.7 135.78,17.03 137.81,18.39 139.15,18.39
N$17
  Bottom 1.93: C2.+ 168.6,46.19 R10.1
  pour Bottom: 164.39,46.18 167.65,42.91 171.21,42.91 167.97,46.16 164.42,46.16
N$18
  Bottom 1.016: K2.A1 146.68,11.54 141.98,11.54 141.7,11.82 LED2.K
  Bottom 1.422: D2.A 143.85,17.06 T6.3 141.7,16.47 LED2.K
N$19
  Bottom 1.016: Q2.1 14.38,18.13 R14.1
N$21
  Bottom 0.61: RTC.1 41.93,46.4 Y1.1
N$22
  Bottom 3.5: K3.11 167.7,21.73 X1.4
N$23
  Bottom 0.61: RTC.3 45.75,48.94 42.96,51.72 39.92,51.72 B1.1
N$24
  Bottom 0.61: Q2.3 16.18,14.26 11.47,14.26 10.5,15.22 R15.1
N$25
  Bottom 0.813: 147.01,16.48 R44.2
  Bottom 1.422: LED2.A 147.01,16.48
N$26
  Bottom 3.5: K1.11 165.74,3.31 X1.6
N$27
  Bottom 1.27: R15.2 9.7,21.14 RFLED.K
N$28
  Bottom 3.5: K2.11 169.65,16.72 X1.5
N$29
  Bottom 1.676: OK5.6 112.75,35.82 R30.1
N$30
  Bottom 1.676: OK6.6 116.63,27.33 R32.2
N$31
  Bottom 1.27: RF.ANT 4.38,51.02 ANT1.1
N$32
  Bottom 1.27: OK3.1 78.4,19.83 76.77,18.21 76.77,16.87 R47.2
N$33
  Bottom 0.813: 94.28,23.02 R50.2
  Bottom 1.27: OK8.3 94.28,23.02
N$34
  Bottom 1.676: OK7.6 R34.1
N$35
  Bottom 0.813: 94.39,17.29 R49.2
  Bottom 1.27: OK3.3 94.39,17.29
N$36
  Bottom 0.61: 139.16,26.56 139.18,26.65
  Bottom 0.813: R49.1 99.55,15.04 99.55,11.25 100.29,10.51 132.31,10.51 134.52,12.65 134.52,18.61 134.49,19.21 139.11,23.83
  Bottom 1.016: T7.2 139.18,26.65 | 139.16,26.56 139.11,24.6 139.11,23.83
N$37
  Bottom 0.813: 100.94,17.9 100.94,12.77 101.97,11.69 130.43,11.69 133.24,14.49 133.24,20.77 137.23,24.75 137.23,38.45 T8.2
  Bottom 1.27: R50.1 97.21,21.63 100.94,17.9
N$38
  Bottom 1.422: K3.A1 146.76,22.48 142.59,22.48 141.82,23.26 LED4.K 141.08,25.72 T7.3 143.82,28.29 D3.A
N$39
  Bottom 3.5: K4.11 165.72,29.7 168.66,26.76 X1.3
N$40
  Bottom 1.422: LED4.A 144.85,24.98 R51.2
N$41
  Bottom 1.27: D4.A 144.06,39.08
  Bottom 1.422: 144.06,39.08 T8.3 141.04,36.46 LED5.K 141.83,34.28 142.58,33.54 146.82,33.54 K4.A1
N$42
  Bottom 1.676: 173.78,26.56 169.13,26.56 165.76,29.93 165.76,34.27
N$43
  Bottom 1.422: LED5.A 147.14,38.43 R52.2
N$44
  Bottom 0.61: R48.2
  Bottom 1.27: OK8.1 77.27,25.56 76.47,24.76 R48.2
N$54
  Bottom 1.422: OK4.4 111.67,38.06 T1.G
N$55
  Bottom 1.422: 131.92,60.51 R35.2 | T1.T1 115.93,50.11 115.21,50.84 115.21,54.69 118.02,57.5 118.02,60.26 C14.1
  Bottom 1.778: C14.1 131.92,60.51
N$56
  Bottom 1.422: 164.21,52.45 R36.2 | 134.91,60.51 R35.1 | 153.95,52.45 149.91,56.48
  Bottom 1.676: 164.21,52.45 153.95,52.45 | 149.91,56.48 147.16,56.48 145.7,57.94
  Bottom 1.778: 134.91,60.51 C14.2 145.7,57.94
N$62
  Bottom 1.422: OK5.4 120.78,30.74 121.73,31.7 121.73,37.87 T2.G
N$63
  Bottom 1.422: 131.56,52.61 R37.2 | 119.77,52.61 C15.1
  Bottom 1.676: T2.T1 121.46,49.56 C15.1
  Bottom 1.778: C15.1 131.56,52.61
  pour Bottom: 121.51,43.48 121.51,49.64 118.38,52.78 128.9,52.78 128.94,52.82 121.52,43.46
N$64  (via drill 1 pad 3)
  Top 1.676: v155.79,55.98 155.43,56.34
  Top 1.778: 155.43,56.34 v140.96,56.34
  Bottom 1.422: 134.49,52.61 R37.1
  Bottom 1.676: 144.74,52.61 C15.2 144.69,52.61 | R38.2 163.71,55.98 v155.79,55.98
  Bottom 1.778: C15.2 142.19,52.61 134.49,52.61
  Bottom 1.93: v140.96,56.34 140.96,53.84 142.19,52.61
N$70
  Bottom 1.676: OK6.4 120.27,22.25 126.66,28.64 T3.G
N$71  (1 unrouted)
  Bottom 1.676: T3.T1 126.66,46.56 129.24,49.14
  Bottom 1.778: 129.24,49.14 147.31,49.14 149.89,51.73 C16.1
  Bottom 1.93: 149.89,60.49 C17.1 151.27,62 R39.2
N$72
  Bottom 1.27: R40.2 164.42,58.89 167.29,61.76 R39.1
  Bottom 1.93: C16.2 177.26,52.49 C17.2 175.81,62 R39.1
  pour Bottom: 177.68,52.61 168.1,62.19 168.1,62.58 175.67,62.58 177.52,60.74 177.52,52.79 177.7,52.62
N$78
  Bottom 1.676: OK7.4 121.72,13.84 127.11,19.22 127.11,22.25 132.06,27.21 132.06,38.26 T4.G
NEUTRAL  (1 unrouted)
  Bottom 1.93: X3.2 112.21,61.79 110.96,63.04 97.56,63.04 96.32,61.8 96.32,58.28 X5.1
OSC1
  Bottom 0.61: R16.1 39.67,28 38.46,29.21 36.53,29.21 IC2.16
OSC2
  Bottom 0.61: IC2.15 40.39,30.5 R16.2
RFD0
  Bottom 0.61: IC2.10 36.49,36.84 39.91,36.84 41.81,38.74 50.47,38.74 50.64,38.91 54.95,38.91 R4.2
  Bottom 1.27: JP1.15 62.82,35.99 60.04,38.76 55.14,38.76 R4.2
RFD1
  Bottom 0.61: R5.2 51.57,36.87 42.13,36.87 40.48,35.55 IC2.11
  Bottom 1.27: R5.2 52.65,35.79 58.15,35.79 63.03,30.91 JP1.19
RFD2
  Bottom 0.61: R6.2 47.33,35.61 43.34,35.61 42.04,34.31 IC2.12
  Bottom 1.27: R6.2 49.55,33.4 57.26,33.4 62.22,28.43 64.26,28.43 JP1.21
RFD3
  Bottom 0.61: R9.2 44.46,33.04 IC2.13
  Bottom 0.813: 52.4,30 53.54,31.14 56.74,31.14 62.05,25.83
  Bottom 1.27: R9.2 44.78,31.19 45.98,30 52.4,30 | 62.05,25.83 JP1.23
RX
  Bottom 0.61: 74.08,43.61 JP3.4
  Bottom 1.016: JP1.10 66.88,43.59 JP3.4
SCL  (via drill 0.8 pad 2.18)
  Top 0.61: v59.7,56.45 v59.7,47.1
  Bottom 0.406: 51.19,51.95 51.19,49.46 51.71,48.94 RTC.6 | 73.01,63.29 61.48,63.29 60.97,62.78
  Bottom 0.61: RTC.6 60.46,48.94 | R7.2 51.19,51.95 | 73.01,63.29 74.2,62.11 JP2.3 | 60.97,61.74 60.97,62.78
  Bottom 1.016: JP1.5 64.08,48.94 60.46,48.94 59.7,48.18 v59.7,47.1 | v59.7,56.45 59.7,60.47 60.97,61.74
SDA
  Bottom 0.61: RTC.5 56.83,50.21 57.85,51.23
  Bottom 1.016: 61.93,59.78 61.93,52.4 63.1,51.23 JP1.3 57.85,51.23 | 61.93,59.78 61.93,59.89 | JP2.4 63.6,61.45 61.93,59.78
  Bottom 1.27: R8.2 56.81,52.26 57.85,51.23
SW-1  (via drill 0.8 pad 2.54)
  Top 0.61: v35.75,23.43 35.75,40.26
  Top 1.27: 35.75,40.26 v35.78,40.29
  Bottom 1.016: 35.78,40.62 37.6,42.43 60.72,42.43 62.08,41.07 JP1.11
  Bottom 1.27: 33.97,11.24 RN1.2 | RN1.2 33.93,21.61 v35.75,23.43 | CN2.2 33.93,5.79 RN1.2 | v35.78,40.29 35.78,40.62
SW-2  (via drill 0.8 pad 2.54)
  Top 0.61: v40.16,23.85 v40.16,40.24
  Bottom 0.61: 52.89,40.24 53.78,41 60.41,41 62.78,38.63
  Bottom 0.813: v40.16,40.24 52.89,40.24 | 62.78,38.63 64.23,38.63 JP1.13
  Bottom 1.27: 36.51,11.24 RN1.3 | RN1.3 36.47,20.16 v40.16,23.85 | CN2.3 36.47,5.79 RN1.3
SW-3
  Bottom 1.27: JP1.29 58.74,18.21 56.15,20.5 41.44,20.5 39.05,18.33 39.05,10.67 39.05,11.24 RN1.4 39.01,5.79 CN2.4
SW-4
  Bottom 1.27: 41.59,11.24 RN1.5 | JP1.31 57.7,15.67 54.87,18.5 43.35,18.5 41.6,16.75 41.6,11.33 RN1.5 | CN2.5 41.55,5.79 RN1.5
TX
  Bottom 0.61: 74.08,46.15 JP3.3
  Bottom 1.016: JP1.8 66.88,46.13 JP3.3
UP
  Bottom 1.27: 44.13,11.24 RN1.6 | JP1.33 56.93,13.13 53.68,16.37 45.35,16.37 44.11,15.14 44.11,11.3 RN1.6 | CN2.6 44.09,5.79 RN1.6

### Text on the board
Bottom: BOT VIEW | HBT Vr4
tPlace: I2C EXT | RF434 | HBT SMPS | Rpi PWR | Vin | 5V | 12V | + | - | - | + | - | + | - | + | +
bPlace: 3V3 | Designed By | HONEY BEES
tNames: 3.3V | GND | TX | RX